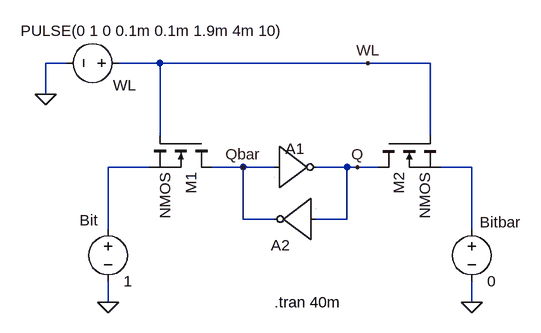
[diagram p0: schematic Writing SRAM Cell.asc]
Writing SRAM Cell.asc, the LTspice schematic file:
Version 4
SHEET 1 880 680
WIRE -144 -32 -176 -32
WIRE 0 -32 -64 -32
WIRE 320 -32 0 -32
WIRE 416 -32 320 -32
WIRE -176 16 -176 -32
WIRE 0 80 0 -32
WIRE 416 80 416 -32
WIRE -16 128 -80 128
WIRE 128 128 80 128
WIRE 176 128 128 128
WIRE 288 128 240 128
WIRE 304 128 288 128
WIRE 336 128 304 128
WIRE 480 128 432 128
WIRE 128 208 128 128
WIRE 176 208 128 208
WIRE 288 208 288 128
WIRE 288 208 240 208
WIRE -80 224 -80 128
WIRE 480 224 480 128
WIRE -80 336 -80 304
WIRE 480 336 480 304
FLAG 320 -32 WL
FLAG 304 128 Q
FLAG 128 128 Qbar
FLAG -80 336 0
FLAG 480 336 0
FLAG -176 16 0
SYMBOL Digital\\inv 176 64 R0
WINDOW 0 17 36 Left 2
SYMATTR InstName A1
SYMBOL Digital\\inv 240 272 R180
SYMATTR InstName A2
SYMBOL nmos 80 80 R90
SYMATTR InstName M1
SYMBOL nmos 336 80 M90
SYMATTR InstName M2
SYMBOL voltage -48 -32 R90
WINDOW 0 50 6 VBottom 2
WINDOW 3 -65 -36 VTop 2
WINDOW 123 0 0 Left 2
WINDOW 39 0 0 Left 2
SYMATTR InstName WL
SYMATTR Value PULSE(0 1 0 0.1m 0.1m 1.9m 4m 10)
SYMBOL voltage -80 208 R0
WINDOW 0 -44 2 Left 2
SYMATTR InstName Bit
SYMATTR Value 1
SYMBOL voltage 480 208 R0
WINDOW 0 12 5 Left 2
SYMATTR InstName Bitbar
SYMATTR Value 0
TEXT 176 336 Left 2 !.tran 40m

The netlist it stands for:
* Writing SRAM Cell.asc
A1 Qbar 0 0 0 0 Q 0 0 BUF
A2 Q 0 0 0 0 Qbar 0 0 BUF
M1 Qbar WL N001 N001 NMOS
M2 Q WL N002 N002 NMOS
V§WL WL 0 PULSE(0 1 0 0.1m 0.1m 1.9m 4m 10)
V§Bit N001 0 1
V§Bitbar N002 0 0
.model NMOS NMOS
.model PMOS PMOS
.lib standard.mos
.tran 40m
.backanno
.end